# EAGLE design breakout (EAGLE 6.4)
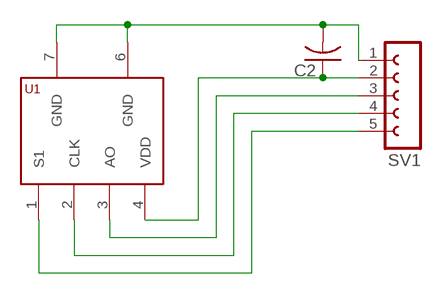
[diagram p0: schematic, sheet 1]

## Parts
C2  C-US025-030X050  [C025-030X050]
SV1  FE05-1  [FE05-1]
U1  TSL1401CL  [TSL8]

## Nets
N$1: C2.2 SV1.1 U1.6(GND) U1.7(GND)
N$2: C2.1 SV1.2 U1.4(VDD)
N$3: SV1.3 U1.3(AO)
N$4: SV1.4 U1.2(CLK)
N$5: SV1.5 U1.1(S1)

## Library data of the parts
C2 = rcl:C-US: CAPACITOR, American symbol
SV1 = con-lsta:FE05-1: FEMALE HEADER; OC_FARNELL: unknown; OC_NEWARK: unknown
U1 = smd-special:TSL1401CL: TSL1401CL Linear CCD Array 128px

## Board
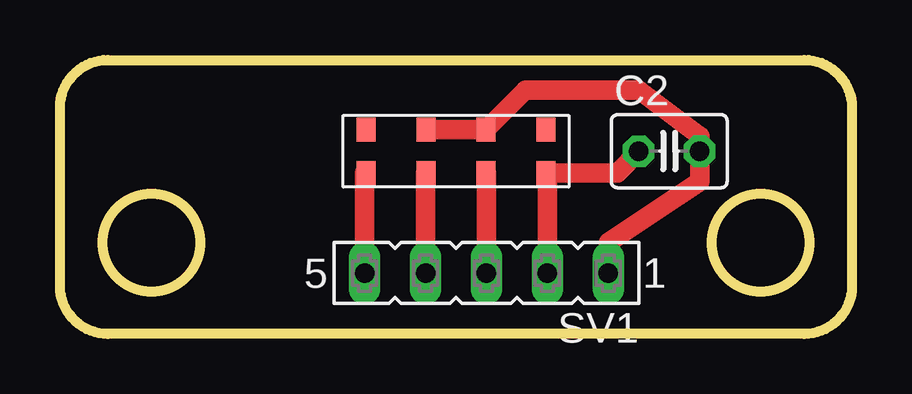
[diagram p1: board, top side]

Size 33.02 x 11.43 mm. Coordinates in mm from the lower left corner, seen from the top.
Outline: 31.02,0 2,0 arc-90 0,2 0,9.43 arc-90 2,11.43 31.02,11.43 arc-90 33.02,9.43 33.02,2 arc-90 31.02,0
Outline: circle at 29.21,3.81 radius 2.03
Outline: circle at 3.81,3.81 radius 2.03
Copper layers (1*16): Top 0.035mm / dielectric 1.5mm / Bottom 0.035mm
Design rules "default": minimum track width 10mil, minimum drill 24mil, track to track 8mil, track to pad 8mil, pad to pad 8mil, via to via 8mil, smd to smd 8mil, copper to edge 40mil, drill to drill 8mil, minimum pad ring 10mil, minimum via ring 8mil, stop-mask expansion 4mil, vias tented up to drill 0mil, thermal gap 10mil

### Footprints (pad centres in the part's own frame; a part is rotated, then mirrored left to right if it is on the bottom)
C025-030X050 = drill 0.813 octagon: 1 -1.27,0; 2 1.27,0
FE05-1 = drill 0.813 long: 1 -5.08,0; 2 -2.54,0; 3 0,0; 4 2.54,0; 5 5.08,0
TSL8 = smd 0.8 x 1: 1 -3.75,-0.9; 2 -1.25,-0.9; 3 1.25,-0.9; 4 3.75,-0.9; 5 3.75,0.9; 6 1.25,0.9; 7 -1.25,0.9; 8 -3.75,0.9

### Placement (x,y rotation side)
C2  25.4,7.62 0 top
SV1  17.78,2.54 180 top
U1  16.51,7.62 0 top

### Tracks (layer width: path | path; a pad name or v marks a point on that pad's centre or on a via)
N$1
  Top 0.813: SV1.1 22.86,3.81 26.67,6.35 C2.2 26.67,8.26 24.13,10.16 19.4,10.16 U1.6 U1.7
N$2
  Top 0.406: U1.4 20.32,6.72
  Top 0.813: 20.32,6.72 SV1.2 | U1.4 23.23,6.72 C2.1
N$3
  Top 0.406: U1.3 17.78,6.72
  Top 0.813: 17.78,6.72 SV1.3
N$4
  Top 0.406: U1.2 15.24,6.72
  Top 0.813: 15.24,6.72 SV1.4
N$5
  Top 0.406: U1.1 12.7,6.72
  Top 0.813: 12.7,6.72 SV1.5